# EAGLE design MCU_Module V1 (EAGLE 7.6.0)
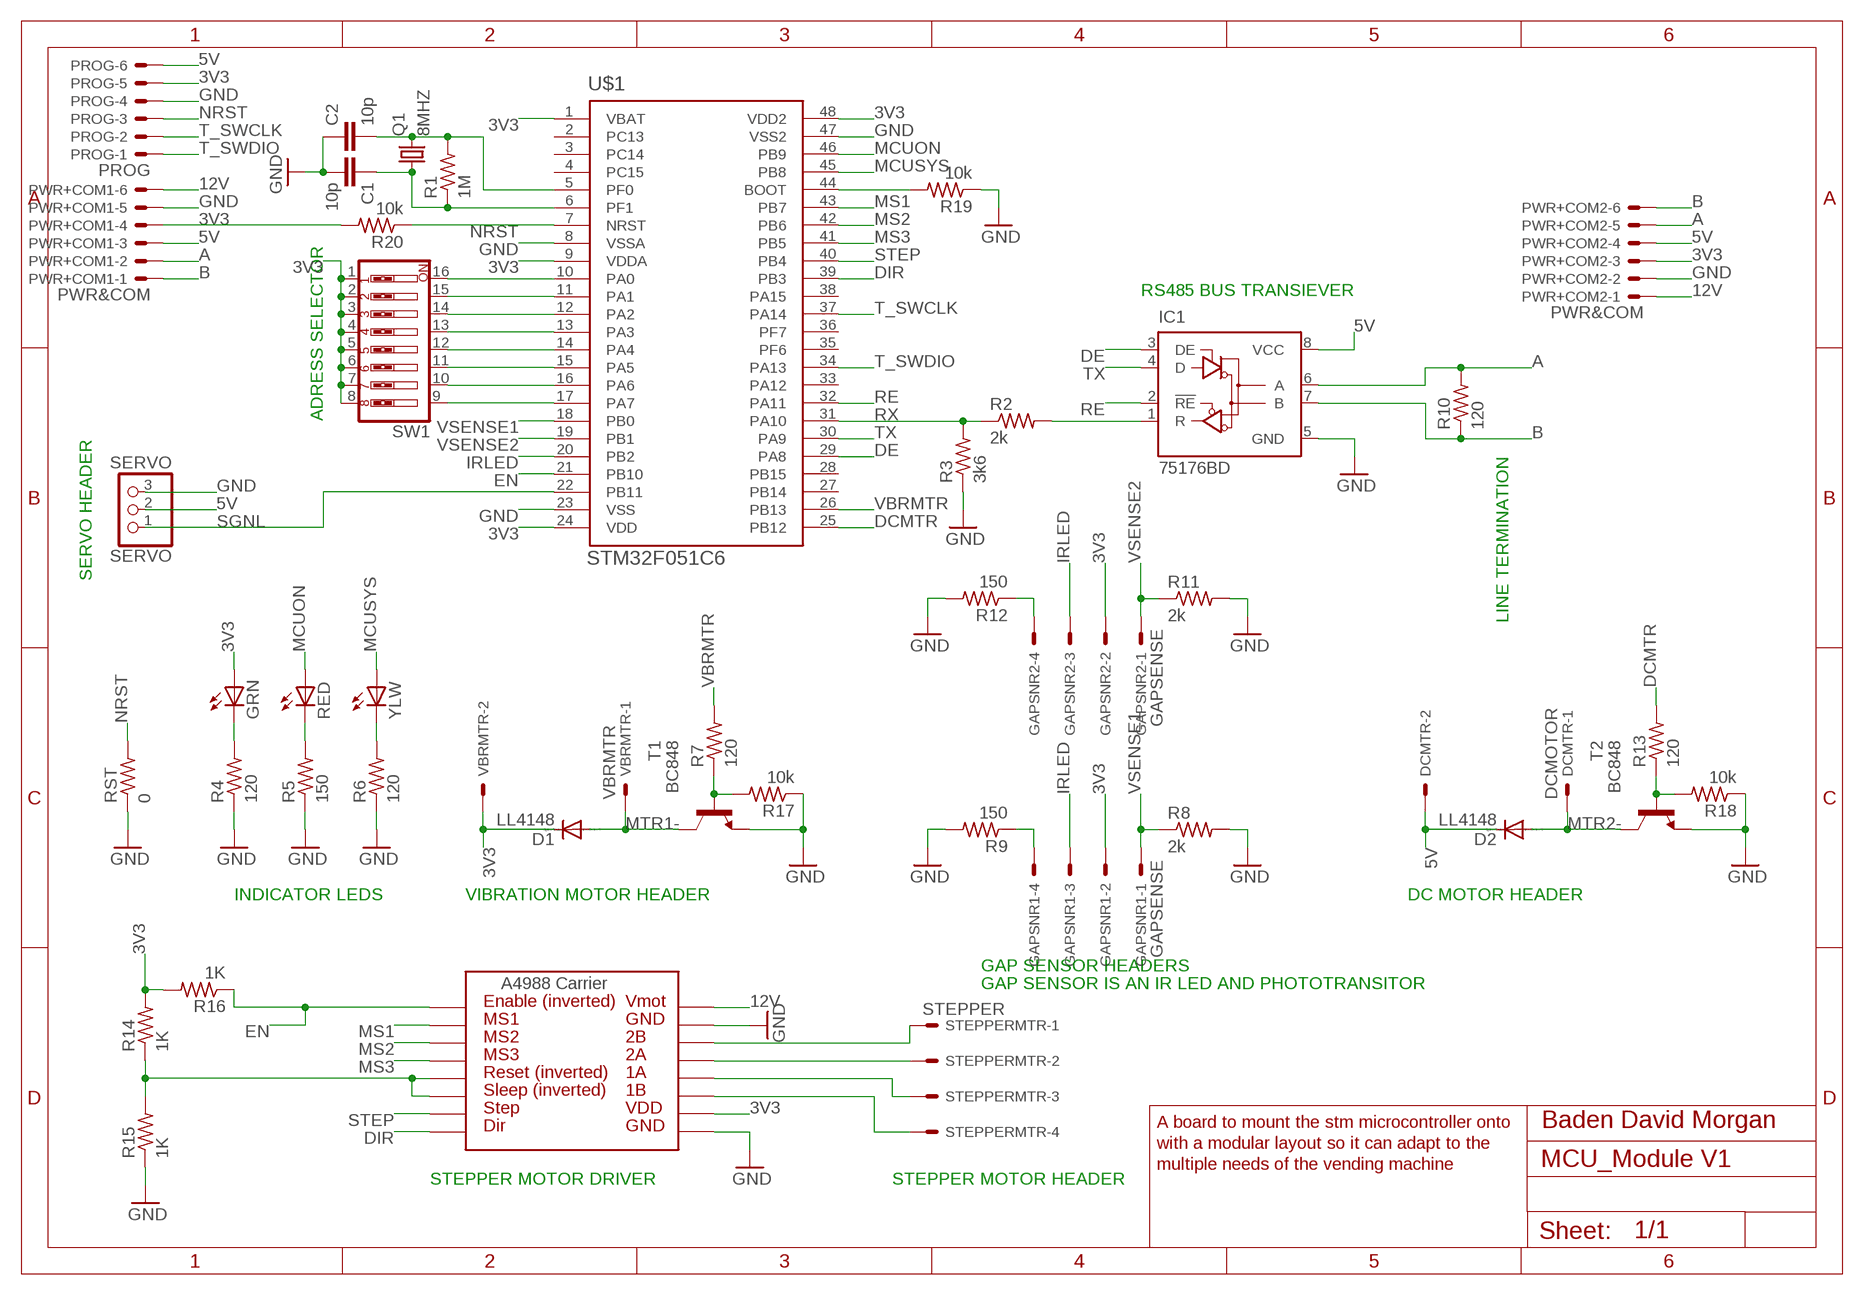
[diagram p0: schematic, sheet 1]

## Parts
C1  10p  C-EUC0805  [C0805]
C2  10p  C-EUC0805  [C0805]
D1  LL4148  PMLL4150  [SOD80C]
D2  LL4148  PMLL4150  [SOD80C]
DCMTR  DCMOTOR  22-27-2021-02  [6410-02]
GAPSNR1  GAPSENSE  22-27-2041-04  [6410-04]
GAPSNR2  GAPSENSE  22-27-2041-04  [6410-04]
GRN  LEDSML1206  [SML1206]
IC1  75176BD  75176AD  [D_R-PDSO-G8]
PROG  PROG  22-27-2061-06  [6410-06]
PWR+COM1  PWR&COM  22-05-7068-06  [7395-06]
PWR+COM2  PWR&COM  22-05-7068-06  [7395-06]
Q1  8MHZ  CRYSTALSM49  [SM49]
R1  1M  R-US_R0805  [R0805]
R2  2k  R-US_R0805  [R0805]
R3  3k6  R-US_R0805  [R0805]
R4  120  R-US_R0805  [R0805]
R5  150  R-US_R0805  [R0805]
R6  120  R-US_R0805  [R0805]
R7  120  R-US_R0805  [R0805]
R8  2k  R-US_R0805  [R0805]
R9  150  R-US_R0805  [R0805]
R10  120  R-US_R0805  [R0805]
R11  2k  R-US_R0805  [R0805]
R12  150  R-US_R0805  [R0805]
R13  120  R-US_R0805  [R0805]
R14  1K  R-US_R0805  [R0805]
R15  1K  R-US_R0805  [R0805]
R16  1K  R-US_R0805  [R0805]
R17  10k  R-US_R0805  [R0805]
R18  10k  R-US_R0805  [R0805]
R19  10k  R-US_R0805  [R0805]
R20  10k  R-US_R0805  [R0805]
RED  LEDSML1206  [SML1206]
RST  0  R-US_R0805  [R0805]
SERVO  SERVO  PINHD-1X3  [1X03]
STEPPERMTR  STEPPER  22-27-2041-04  [6410-04]
SW1  SW_DIP-8  [EDG-08]
T1  BC848  [SOT23]
T2  BC848  [SOT23]
U$1  STM32F051C6  [QFP50P900X900X160-48N]
U$2  A4983CARRIER  [A4988BREAKOUT]
VBRMTR  VBRMTR  22-27-2021-02  [6410-02]
YLW  LEDSML1206  [SML1206]

## Nets
3V3: D1.C GAPSNR1.2 GAPSNR2.2 GRN.A PROG.5 PWR+COM1.4 PWR+COM2.3 R14.2 R16.2 R20.2 SW1.1 SW1.2 SW1.3 SW1.4 SW1.5 SW1.6 SW1.7 SW1.8 U$1.1(VBAT) U$1.9(VDDA) U$1.24(VDD) U$1.48(VDD2) U$2.VDD VBRMTR.2
5V: D2.C DCMTR.2 IC1.8(VCC) PROG.6 PWR+COM1.3 PWR+COM2.4 SERVO.2
12V: PWR+COM1.6 PWR+COM2.1 U$2.VMOT
A: IC1.6(A) PWR+COM1.2 PWR+COM2.5 R10.2
B: IC1.7(B) PWR+COM1.1 PWR+COM2.6 R10.1
DCMTR: R13.2 U$1.25(PB12)
DE: IC1.3(DE) U$1.29(PA8)
DIR: U$1.39(PB3) U$2.DIR
EN: R16.1 U$1.21(PB10) U$2.EN
GND: C1.2 C2.1 IC1.5(GND) PROG.4 PWR+COM1.5 PWR+COM2.2 R3.1 R4.1 R5.1 R6.1 R8.2 R9.2 R11.2 R12.2 R15.1 R17.1 R18.1 R19.1 RST.1 SERVO.3 T1.2(E) T2.2(E) U$1.8(VSSA) U$1.23(VSS) U$1.47(VSS2) U$2.GND U$2.GND@0(GND)
IRLED: GAPSNR1.3 GAPSNR2.3 U$1.20(PB2)
MCUON: RED.A U$1.46(PB9)
MCUSYS: U$1.45(PB8) YLW.A
MS1: U$1.43(PB7) U$2.MS1
MS2: U$1.42(PB6) U$2.MS2
MS3: U$1.41(PB5) U$2.MS3
MTR1-: D1.A T1.3(C) VBRMTR.1
MTR2-: D2.A DCMTR.1 T2.3(C)
N$1: C1.1 Q1.1 R1.1 U$1.6(PF1)
N$2: C2.2 Q1.2 R1.2 U$1.5(PF0)
N$3: SW1.16 U$1.10(PA0)
N$4: R13.1 R18.2 T2.1(B)
N$5: STEPPERMTR.4 U$2.1B
N$6: SW1.15 U$1.11(PA1)
N$7: SW1.14 U$1.12(PA2)
N$8: SW1.13 U$1.13(PA3)
N$9: IC1.1(R) R2.2
N$10: SW1.12 U$1.14(PA4)
N$11: SW1.11 U$1.15(PA5)
N$12: SW1.10 U$1.16(PA6)
N$13: SW1.9 U$1.17(PA7)
N$14: GRN.C R4.2
N$15: R5.2 RED.C
N$16: R6.2 YLW.C
N$17: R7.1 R17.2 T1.1(B)
N$18: STEPPERMTR.3 U$2.1A
N$19: GAPSNR1.4 R9.1
N$20: STEPPERMTR.2 U$2.2A
N$21: STEPPERMTR.1 U$2.2B
N$22: R19.2 U$1.44(BOOT)
N$24: GAPSNR2.4 R12.1
N$26: R14.1 R15.2 U$2.RST U$2.SLP(SLEEP)
NRST: PROG.3 R20.1 RST.2 U$1.7(NRST)
RE: IC1.2(!RE) U$1.32(PA11)
RX: R2.1 R3.2 U$1.31(PA10)
SGNL: SERVO.1 U$1.22(PB11)
STEP: U$1.40(PB4) U$2.STEP
T_SWCLK: PROG.2 U$1.37(PA14)
T_SWDIO: PROG.1 U$1.34(PA13)
TX: IC1.4(D) U$1.30(PA9)
VBRMTR: R7.2 U$1.26(PB13)
VSENSE1: GAPSNR1.1 R8.1 U$1.18(PB0)
VSENSE2: GAPSNR2.1 R11.1 U$1.19(PB1)
Unconnected: U$1.2(PC13) U$1.3(PC14) U$1.4(PC15) U$1.27(PB14) U$1.28(PB15) U$1.33(PA12) U$1.35(PF6) U$1.36(PF7) U$1.38(PA15)

## Notes on the sheet
- RS485 BUS TRANSIEVER
- ADRESS SELECTOR
- LINE TERMINATION
- SERVO HEADER
- INDICATOR LEDS | VIBRATION MOTOR HEADER | DC MOTOR HEADER
- GAP SENSOR HEADERS
- GAP SENSOR IS AN IR LED AND PHOTOTRANSITOR
- A board to mount the stm microcontroller onto | Baden David Morgan
- with a modular layout so it can adapt to the
- multiple needs of the vending machine
- STEPPER MOTOR DRIVER | STEPPER MOTOR HEADER

## Library data of the parts
C1 C2 = rcl:C-EU: CAPACITOR, European symbol
D1 D2 = diode:PMLL4150: DIODE high speed
DCMTR VBRMTR = con-molex:22-?-02: CONNECTOR wire to board 2.54 mm (.1 inch) pitch header; OC_FARNELL: unknown; OC_NEWARK: unknown
GAPSNR1 GAPSNR2 STEPPERMTR = con-molex:22-?-04: CONNECTOR wire to board 2.54 mm (.1 inch) pitch header; OC_FARNELL: unknown; OC_NEWARK: unknown
GRN RED YLW = led:LED: LED OSRAM: - CHIPLED LG R971, LG N971, LY N971, LG Q971, LY Q971, LO R971, LY R971 LH N974, LH R974 LS Q976, LO Q976, LY Q976 LO Q996 - Hyper CHIPLED LW Q18S LB Q993, LB Q99A, LB R99A - SideLED LS A670, LO A670, LY A670, LG A670, LP A670 LB A673, LV A673, LT A673, LW A673 LH A674 LY A675 LS A676, LA A676, LO A676, LY A676, LW A676 LS A679, LY A679, LG A679 - Hyper Micro SIDELED® LS Y876, LA Y876, LO Y876, LY Y876 LT Y87S - SmartLED LW L88C, LW L88S LB L89C, LB L89S, LG L890 LS L89K, LO L89K, LY L89K LS L896, LA L896, LO L896, LY L896 - TOPLED LS T670, LO T670, LY T670, LG T670, LP T670 LSG T670, LSP T670, LSY T670, LOP T670, LYG T670 LG T671, LOG T671, LSG T671 LB T673, LV T673, LT T673, LW T673 LH T674 LS T676, LA T676, LO T676, LY T676, LB T676, LH T676, LSB T676, LW T676 LB T67C, LV T67C, LT T67C, LS T67K, LO T67K, LY T67K, LW E67C LS E67B, LA E67B, LO E67B, LY E67B, LB E67C, LV E67C, LT E67C LW T67C LS T679, LY T679, LG T679 LS T770, LO T770, LY T770, LG T770, LP T770 LB T773, LV T773, LT T773, LW T773 LH T774 LS E675, LA E675, LY E675, LS T675 LS T776, LA T776, LO T776, LY T776, LB T776 LHGB T686 LT T68C, LB T68C - Hyper Mini TOPLED® LB M676 - Mini TOPLED Santana® LG M470 LS M47K, LO M47K, LY M47K Source: http://www.osram.convergy.de LUXEON: - LUMILED® LXK2-PW12-R00, LXK2-PW12-S00, LXK2-PW14-U00, LXK2-PW14-V00 LXK2-PM12-R00, LXK2-PM12-S00, LXK2-PM14-U00 LXK2-PE12-Q00, LXK2-PE12-R00, LXK2-PE12-S00, LXK2-PE14-T00, LXK2-PE14-U00 LXK2-PB12-K00, LXK2-PB12-L00, LXK2-PB12-M00, LXK2-PB14-N00, LXK2-PB14-P00, LXK2-PB14-Q00 LXK2-PR12-L00, LXK2-PR12-M00, LXK2-PR14-Q00, LXK2-PR14-R00 LXK2-PD12-Q00, LXK2-PD12-R00, LXK2-PD12-S00 LXK2-PH12-R00, LXK2-PH12-S00 LXK2-PL12-P00, LXK2-PL12-Q00, LXK2-PL12-R00 Source: www.luxeon.com KINGBRIGHT: KA-3528ASYC Source: www.kingbright.com
IC1 = 751xx:75176A: DIFFERENTIAL BUS TRANSCEIVER Source: http://focus.ti.com/lit/ds/symlink/sn75176a.pdf
PROG PWR+COM1 PWR+COM2 = con-molex:22-?-06: CONNECTOR wire to board 2.54 mm (.1 inch) pitch header; OC_FARNELL: unknown; OC_NEWARK: unknown
Q1 = crystal:CRYSTAL: CRYSTAL; OC_FARNELL: unknown; OC_NEWARK: unknown
R1 R4-R7 R9 R12-R20 RST = rcl:R-US_: RESISTOR, American symbol
R2 R3 R8 R10 R11 = resistor:R-US_: RESISTOR, American symbol
SERVO = pinhead:PINHD-1X3: PIN HEADER
SW1 = special:SW_DIP-8: DIP SWITCH
T1 T2 = transistor:BC848: NPN TRANSISTOR
U$1 = STM32F0:STM32F051C6
U$2 = RepRapjr:A4983CARRIER

## Board
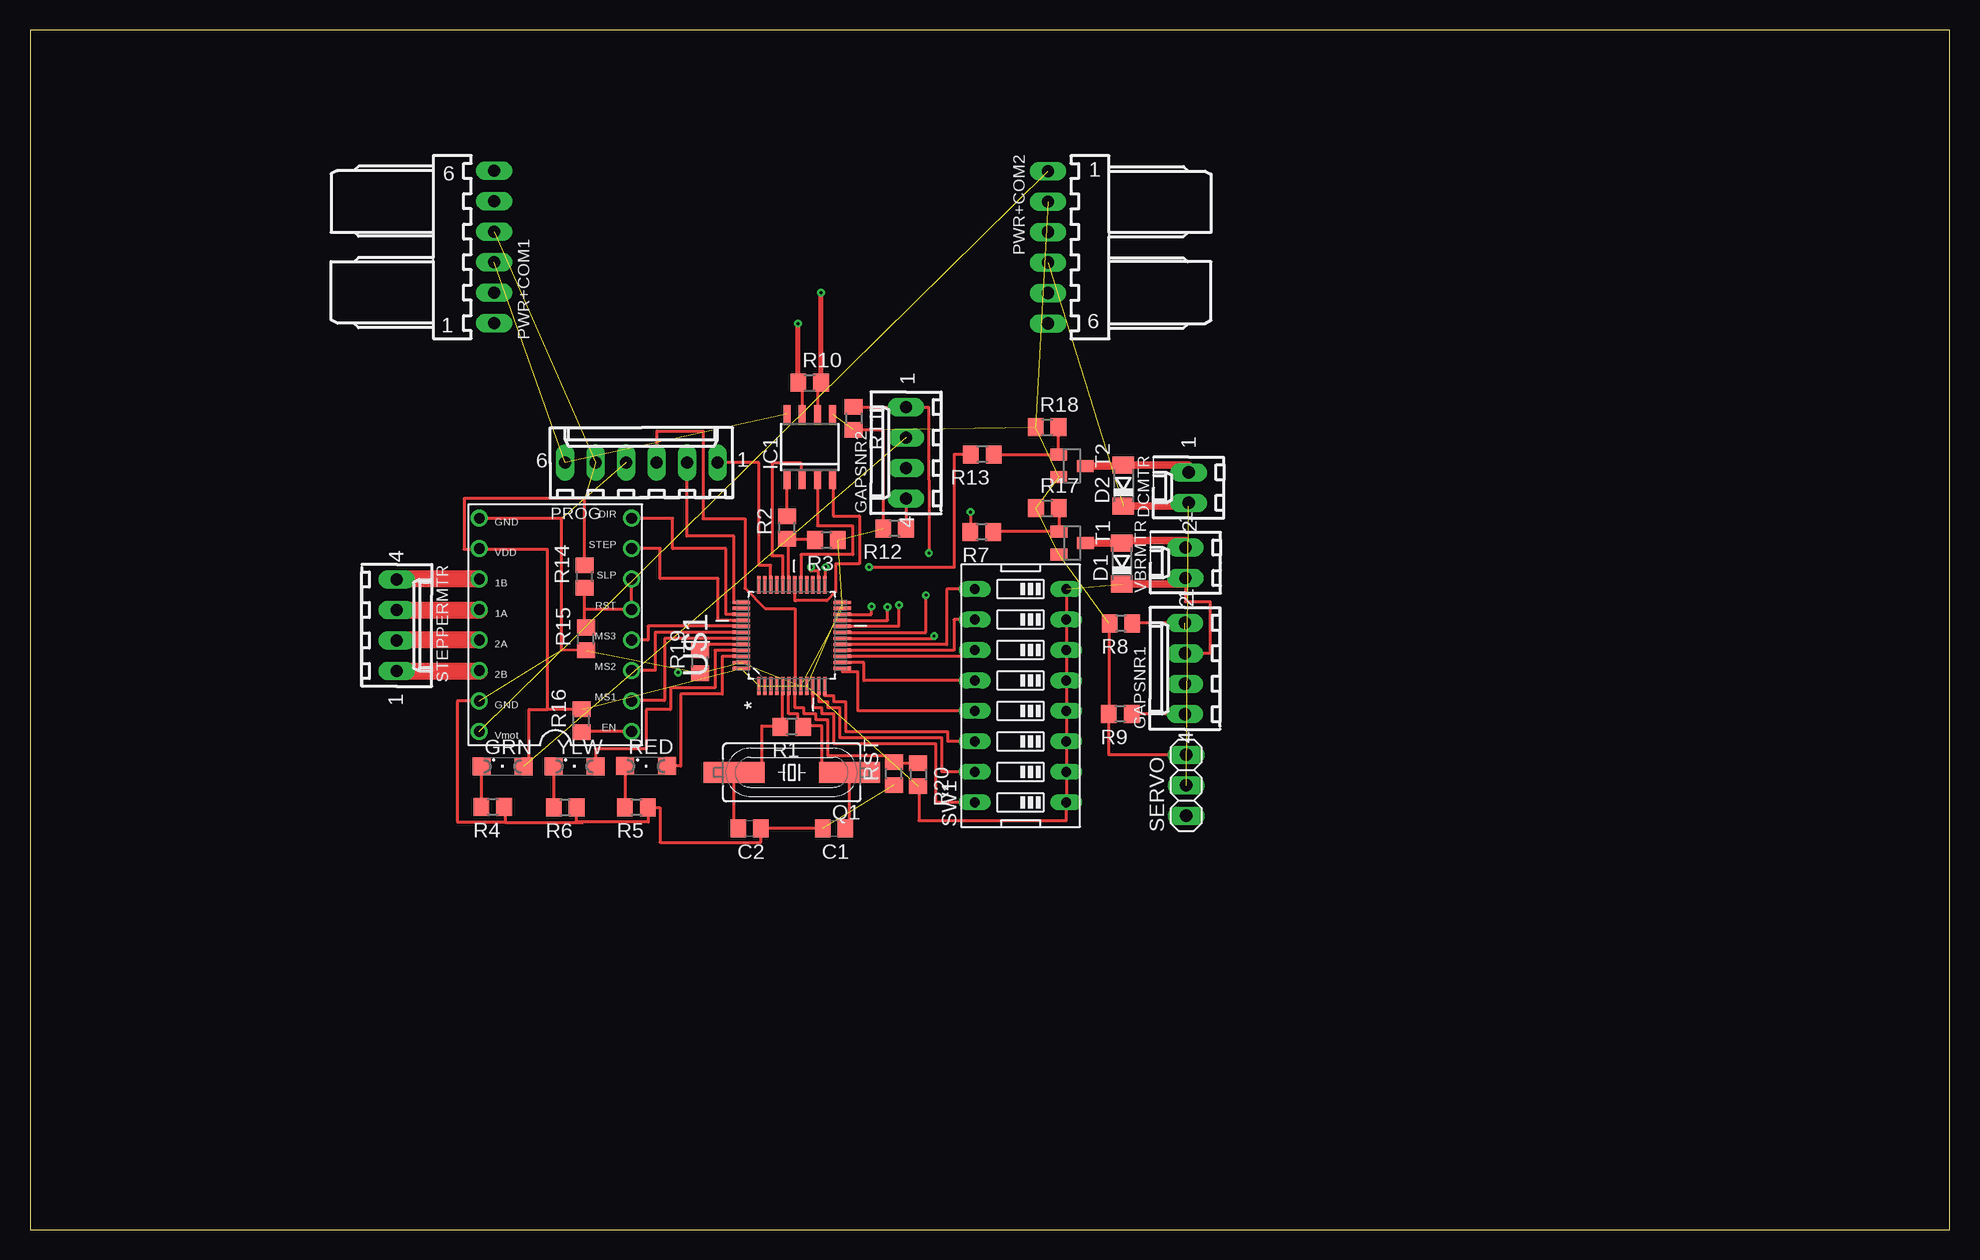
[diagram p1: board, top side]
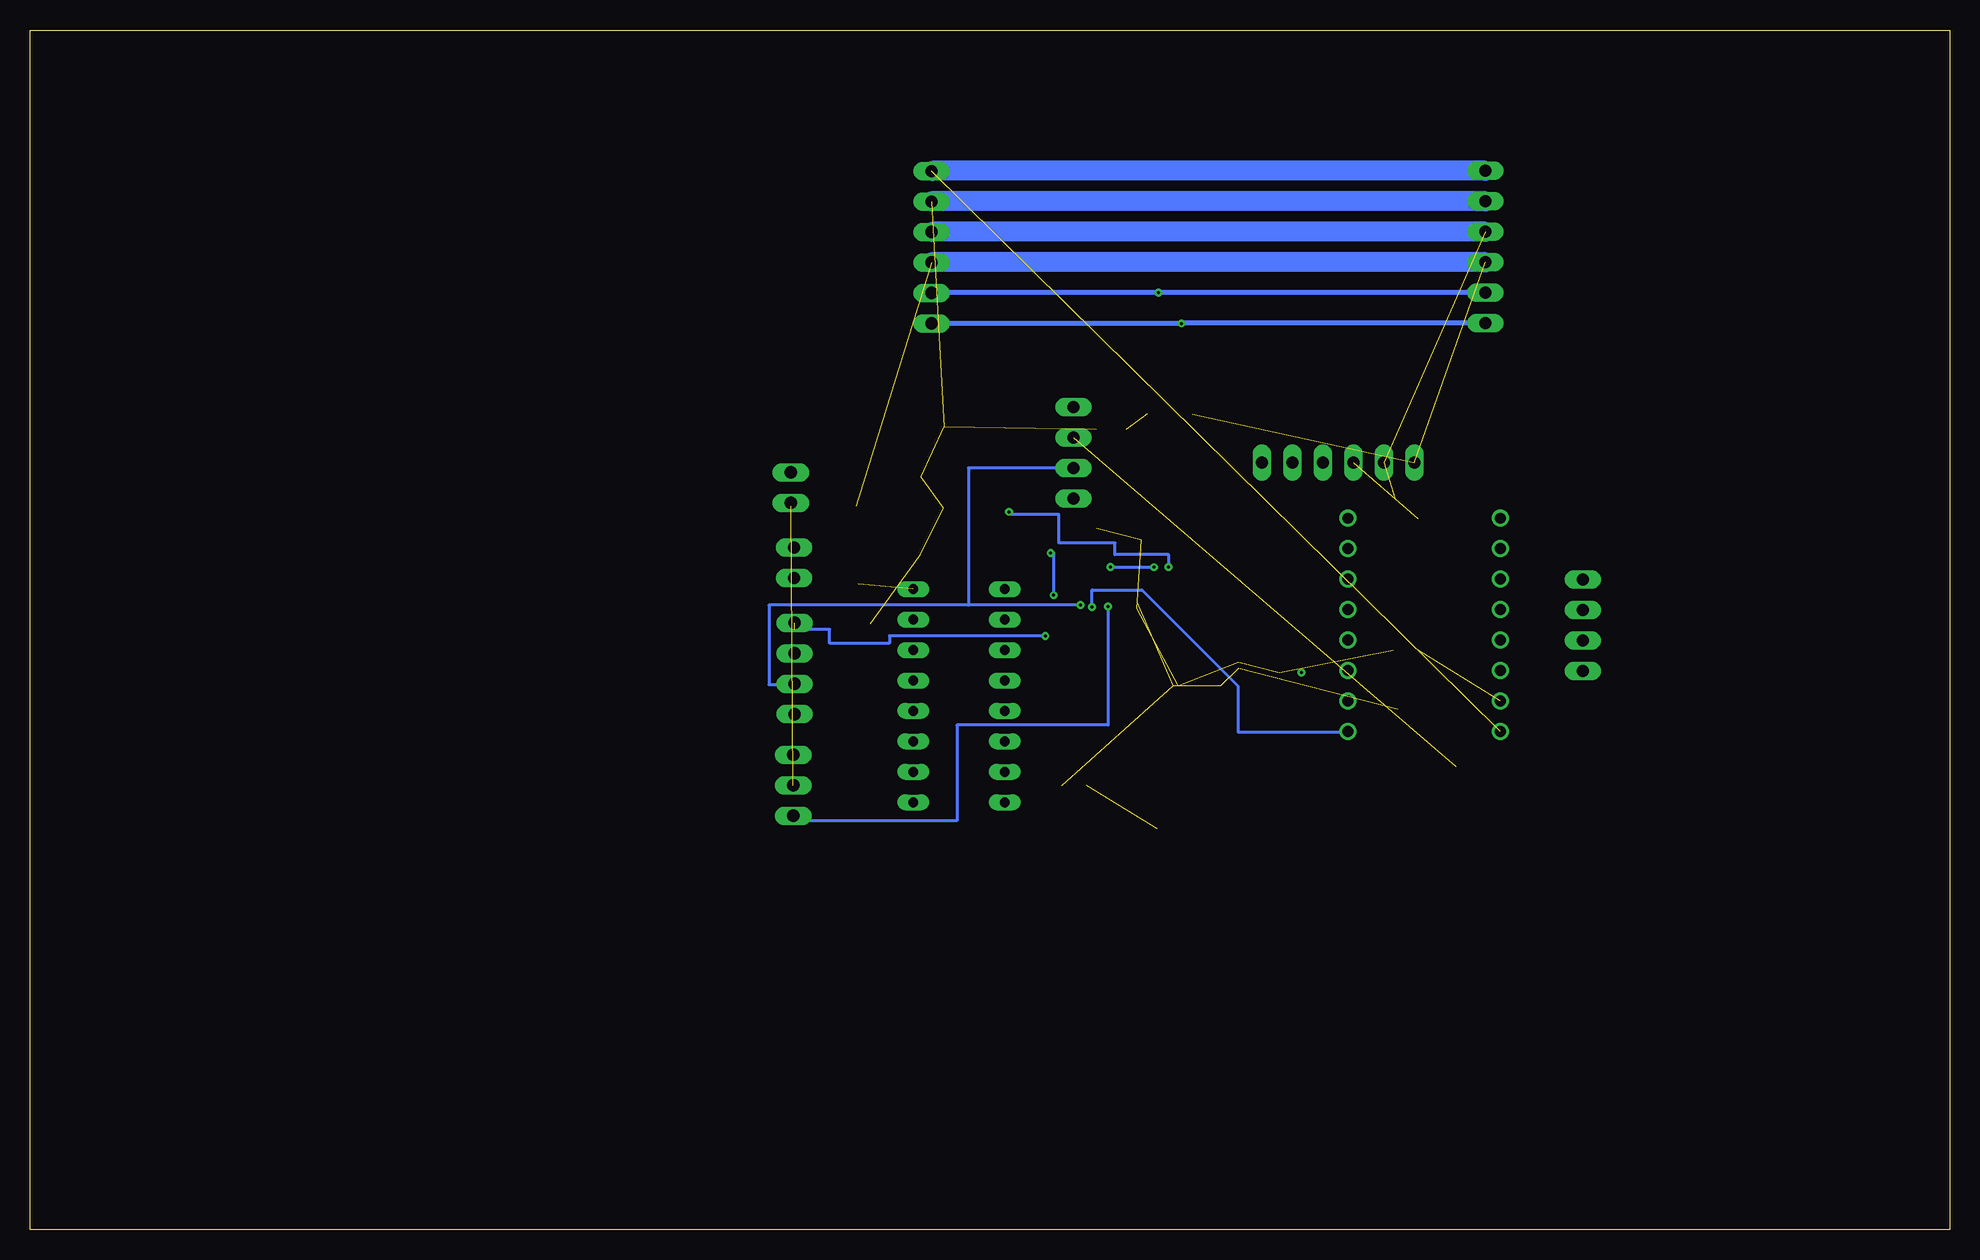
[diagram p2: board, bottom side, seen from below]

Size 160 x 100 mm. Coordinates in mm from the lower left corner, seen from the top.
Outline: 0,0 160,0 160,100 0,100 0,0
Copper layers (1*16): Top 0.035mm / dielectric 1.5mm / Bottom 0.035mm
Design rules "default *": minimum track width 10mil, minimum drill 0.25mil, track to track 8mil, track to pad 8mil, pad to pad 8mil, via to via 8mil, smd to smd 8mil, copper to edge 40mil, drill to drill 8mil, minimum pad ring 10mil, minimum via ring 8mil, stop-mask expansion 4mil, vias tented up to drill 0mil, thermal gap 10mil

### Footprints (pad centres in the part's own frame; a part is rotated, then mirrored left to right if it is on the bottom)
C0805 = smd 1.3 x 1.5: 1 -0.95,0; 2 0.95,0
SOD80C = smd 1.4 x 1.8: A 1.7,0; C -1.7,0
6410-02 = drill 1.016 long: 1 1.27,0; 2 -1.27,0
6410-04 = drill 1.016 long: 1 3.81,0; 2 1.27,0; 3 -1.27,0; 4 -3.81,0
SML1206 = smd 1.5 x 1.5: A 1.75,0; C -1.75,0
D_R-PDSO-G8 = smd 0.6 x 1.5: 1 -1.905,-2.75; 2 -0.635,-2.75; 3 0.635,-2.75; 4 1.905,-2.75; 5 1.905,2.75; 6 0.635,2.75; 7 -0.635,2.75; 8 -1.905,2.75
6410-06 = drill 1.016 long: 1 6.35,0; 2 3.81,0; 3 1.27,0; 4 -1.27,0; 5 -3.81,0; 6 -6.35,0
7395-06 = drill 1.016 long: 1 6.35,0; 2 3.81,0; 3 1.27,0; 4 -1.27,0; 5 -3.81,0; 6 -6.35,0
SM49 = smd 5.08 x 1.778: 1 -4.826,0; 2 4.826,0
R0805 = smd 1.3 x 1.5: 1 -0.95,0; 2 0.95,0
1X03 = drill 1.016 long: 1 -2.54,0; 2 0,0; 3 2.54,0
EDG-08 = drill 0.813 long: 1 -8.89,-3.81; 2 -6.35,-3.81; 3 -3.81,-3.81; 4 -1.27,-3.81; 5 1.27,-3.81; 6 3.81,-3.81; 7 6.35,-3.81; 8 8.89,-3.81; 9 8.89,3.81; 10 6.35,3.81; 11 3.81,3.81; 12 1.27,3.81; 13 -1.27,3.81; 14 -3.81,3.81; 15 -6.35,3.81; 16 -8.89,3.81
SOT23 = smd 1 x 1.4: 1 -0.95,-1.1; 2 0.95,-1.1; 3 0,1.1
QFP50P900X900X160-48N = smd 1.473 x 0.279: 1 -4.216,2.743; 2 -4.216,2.261; 3 -4.216,1.753; 4 -4.216,1.245; 5 -4.216,0.762; 6 -4.216,0.254; 7 -4.216,-0.254; 8 -4.216,-0.762; 9 -4.216,-1.245; 10 -4.216,-1.753; 11 -4.216,-2.261; 12 -4.216,-2.743; 25 4.216,-2.743; 26 4.216,-2.261; 27 4.216,-1.753; 28 4.216,-1.245; 29 4.216,-0.762; 30 4.216,-0.254; 31 4.216,0.254; 32 4.216,0.762; 33 4.216,1.245; 34 4.216,1.753; 35 4.216,2.261; 36 4.216,2.743 | smd 0.279 x 1.473: 13 -2.743,-4.216; 14 -2.261,-4.216; 15 -1.753,-4.216; 16 -1.245,-4.216; 17 -0.762,-4.216; 18 -0.254,-4.216; 19 0.254,-4.216; 20 0.762,-4.216; 21 1.245,-4.216; 22 1.753,-4.216; 23 2.261,-4.216; 24 2.743,-4.216; 37 2.743,4.216; 38 2.261,4.216; 39 1.753,4.216; 40 1.245,4.216; 41 0.762,4.216; 42 0.254,4.216; 43 -0.254,4.216; 44 -0.762,4.216; 45 -1.245,4.216; 46 -1.753,4.216; 47 -2.261,4.216; 48 -2.743,4.216
A4988BREAKOUT = drill 0.9: 1A 8.89,1.27; 1B 11.43,1.27; 2A 6.35,1.27; 2B 3.81,1.27; DIR 16.51,-11.43; EN -1.27,-11.43; GND 16.51,1.27; GND@0 1.27,1.27; MS1 1.27,-11.43; MS2 3.81,-11.43; MS3 6.35,-11.43; RST 8.89,-11.43; SLP 11.43,-11.43; STEP 13.97,-11.43; VDD 13.97,1.27; VMOT -1.27,1.27

### Placement (x,y rotation side)
C1  67.02,33.42 180 top
C2  59.98,33.42 180 top
D1  91,55.52 90 top
D2  91.13,62.02 90 top
DCMTR  96.58,61.85 90 top
GAPSNR1  96.27,46.77 90 top
GAPSNR2  73.02,64.75 90 top
GRN  39.38,38.61 0 top
IC1  65,65.23 0 top
PROG  50.96,63.93 0 top
PWR+COM1  38.69,81.91 270 top
PWR+COM2  84.86,81.89 90 top
Q1  63.5,38.1 180 top
R1  63.5,41.91 180 top
R2  63.11,58.52 90 top
R3  66.39,57.46 180 top
R4  38.57,35.21 180 top
R5  50.54,35.18 180 top
R6  44.61,35.17 180 top
R7  79.34,58.15 180 top
R8  90.94,50.53 180 top
R9  90.87,42.97 180 top
R10  64.99,70.59 0 top
R11  68.66,67.62 270 top
R12  72.07,58.43 180 top
R13  79.37,64.62 180 top
R14  46.23,54.44 90 top
R15  46.34,49.24 90 top
R16  45.96,42.42 90 top
R17  84.8,60.13 0 top
R18  84.78,66.88 0 top
R19  55.86,47.33 90 top
R20  74.04,37.91 270 top
RED  51.35,38.63 0 top
RST  72,38 90 top
SERVO  96.38,37.04 90 top
STEPPERMTR  30.57,50.37 270 top
SW1  82.57,44.5 90 top
T1  86.87,57.22 270 top
T2  86.85,63.66 270 top
U$1  63.5,49.53 90 top
U$2  38.72,42.79 90 top
VBRMTR  96.32,55.59 90 top
YLW  45.39,38.62 0 top

### Tracks (layer width: path | path; a pad name or v marks a point on that pad's centre or on a via)
3V3  (9 unrouted)
  Top 0.254: SW1.8 SW1.7 SW1.6 SW1.5 SW1.4 SW1.3 SW1.2 SW1.1 86.38,34.1 74.1,34.1 74.1,36.96 R20.2 | VBRMTR.2 96.3,54.32 96.3,52.34 98.37,52.34 98.37,48.04 GAPSNR1.2 | R14.2 46.24,55.48 46.24,60.93 36.18,60.92 36.18,56.72 37.45,56.72 U$2.VDD 37.45,56.68 43.14,56.69 43.14,56.42 43.13,56.41 43.13,43.37 | R16.2 43.13,43.37 | GRN.A 41.61,38.61 41.61,43.37 43.13,43.37
  Top 0.61: D1.C 96.32,53.82 VBRMTR.2
  Bottom 1.422: 84.79,83.18 PWR+COM2.3
  Bottom 1.676: PWR+COM1.4 84.79,83.18
5V  (4 unrouted)
  Top 0.61: D2.C 96.58,60.32 DCMTR.2
  Bottom 1.676: PWR+COM1.3 84.86,80.64 PWR+COM2.4
12V  (1 unrouted)
  Bottom 1.422: 84.79,88.26 PWR+COM2.1
  Bottom 1.676: PWR+COM1.6 84.79,88.26
A  (via drill 0.25)
  Top 0.254: R10.2 65.64,70.59 IC1.6
  Top 0.406: R10.2 v65.95,78.11
  Bottom 0.406: PWR+COM1.2 v65.95,78.1 v65.95,78.11 84.86,78.11 PWR+COM2.5
B  (via drill 0.25)
  Top 0.254: R10.1 64.36,70.59 IC1.7
  Top 0.406: R10.1 64.02,70.59 v64.02,75.54
  Bottom 0.406: PWR+COM1.1 64.02,75.56 v64.02,75.54 PWR+COM2.6
DCMTR  (via drill 0.25)
  Top 0.254: U$1.25 v66.32,55.21 | v69.94,55.22 77.05,55.22 77.05,64.63 R13.2
  Bottom 0.254: v69.94,55.22 66.25,55.22 v66.32,55.21
DE
  Top 0.254: IC1.3 65.63,58.68 68.58,58.68 68.58,56.33 68.59,56.33 68.59,56.27 64.26,56.27 U$1.29
DIR
  Top 0.254: U$1.39 58,51.28 58,56.77 53.57,56.77 53.57,59.28 50.15,59.28 U$2.DIR
EN  (via drill 0.25)
  Top 0.254: U$1.21 71.48,50.77 v71.48,51.9 | U$2.EN 45.97,41.52 R16.1
  Bottom 0.254: v71.48,51.9 71.46,51.9 71.46,53.33 67.32,53.33 59.3,45.31 59.3,41.48 59.31,41.47 50.2,41.47 U$2.EN
GND  (16 unrouted)
  Top 0.254: C1.2 C2.1 60.93,32.29 52.51,32.29 52.51,35.18 R5.1 51.53,35.18 51.53,33.96 46.09,33.96 | R8.2 89.92,50.53 R9.2 89.92,39.58 SERVO.3 | R15.1 44.32,48.31 44.32,59.29 U$2.GND | 46.09,33.96 45.56,33.96 R6.1 | R4.1 39.59,35.21 39.59,33.99 | 46.09,33.96 46.09,33.94 39.59,33.94 39.59,33.99 | U$2.GND@0 35.61,44.06 35.61,33.99 39.59,33.99 | R11.2 71.12,66.67 R12.2
  Bottom 1.676: PWR+COM1.5 84.86,85.72 PWR+COM2.2
IRLED  (via drill 0.26)
  Top 0.254: U$1.20 72.43,50.29 v72.43,52.06
  Bottom 0.254: v72.43,52.06 81.79,52.06 | 81.79,52.06 98.4,52.06 98.4,45.42 96.27,45.42 GAPSNR1.3 | GAPSNR2.3 81.79,63.48 81.79,52.06
MCUON
  Top 0.254: U$1.46 57.69,47.78 57.69,44.64 54.24,44.64 54.24,38.63 RED.A
MCUSYS
  Top 0.254: U$1.45 57.1,48.28 57.1,45.15 53.38,45.15 53.38,43.34 51.37,43.34 51.37,40.07 47.14,40.07 YLW.A
MS1
  Top 0.254: U$1.43 52.91,49.29 52.89,44.09 50.15,44.09 U$2.MS1
MS2
  Top 0.254: U$1.42 52.12,49.78 52.12,46.62 50.15,46.62 U$2.MS2
MS3
  Top 0.254: U$1.41 51.52,50.29 51.52,49.13 U$2.MS3
MTR1-
  Top 0.61: T1.3 D1.A 91.14,57.22 91.14,57.42 96.32,57.42 VBRMTR.1
MTR2-
  Top 0.61: T2.3 91.13,63.66 D2.A 96.58,63.72 DCMTR.1
N$1
  Top 0.254: U$1.6 63.25,43 64,43 64,41.91 R1.1 64.45,42 66,42 66,38.1 Q1.1 68.33,33.42 C1.1
N$2
  Top 0.254: U$1.5 62.74,41.91 R1.2 62.55,42 61,42 61,38.1 Q1.2 58.67,33.42 C2.2
N$3
  Top 0.254: SW1.16 75.5,35.61 75.5,40.5 67,40.5 67,43 66,43 66,43.5 65.25,43.5 U$1.10
N$4
  Top 0.254: R18.2 85.73,64.61 T2.1 R13.1
N$5
  Top 0.254: 30.57,54.22 STEPPERMTR.4
  Top 1.422: U$2.1B 30.57,54.22
N$6
  Top 0.254: SW1.15 76,38.15 76,41 67.5,41 67.5,43.5 66.5,43.5 66.5,44 65.76,44 U$1.11
N$7
  Top 0.254: SW1.14 76.5,40.69 76.5,41.5 68,41.5 68,44 67,44 67,44.5 66.24,44.5 U$1.12
N$8
  Top 0.254: SW1.13 69,43.23 69,46.5 67.72,46.5 U$1.13
N$9
  Top 0.254: R2.2 63.09,59.47 IC1.1
N$10
  Top 0.254: SW1.12 69.5,45.77 69.5,47.27 U$1.14
N$11
  Top 0.254: SW1.11 78.8,48.31 78.77,47.78 U$1.15
N$12
  Top 0.254: SW1.10 77,50.85 77,48.28 67.76,48.28 U$1.16
N$13
  Top 0.254: SW1.9 76.4,53.39 76.41,48.77 U$1.17
N$14
  Top 0.254: GRN.C R4.2
N$15
  Top 0.254: RED.C R5.2
N$16
  Top 0.254: YLW.C 43.66,38.62 R6.2
N$17
  Top 0.254: R7.1 80.29,58.17 T1.1 85.77,60.13 R17.2
N$18
  Top 0.254: 37.45,51.64 U$2.1A
  Top 1.422: STEPPERMTR.3 37.45,51.64
N$19
  Top 0.254: GAPSNR1.4 R9.1
N$20
  Top 0.254: 30.57,49.14 STEPPERMTR.2
  Top 1.422: U$2.2A 30.57,49.14
N$21
  Top 0.254: 37.45,46.56 U$2.2B
  Top 1.422: STEPPERMTR.1 37.45,46.56
N$22
  Top 0.254: U$1.44 56.12,48.77 R19.2
N$23  (via drill 0.25)
  other vias: 54.03,46.43
N$24
  Top 0.254: GAPSNR2.4 R12.1
N$26
  Top 0.254: U$2.SLP U$2.RST 46.23,51.68 | R15.2 46.23,50.63 46.23,51.68 | 46.23,51.68 R14.1
NRST
  Top 0.254: R20.1 72,38.86 RST.2 72,39.5 66.5,39.5 66.5,42.5 65.5,42.5 65.5,43 64.5,43 64.5,43.5 63.75,43.5 U$1.7 63.75,51.76 61.29,51.76 59.59,53.46 59.59,59.26 56.09,59.26 56.09,66.57 52.26,66.57 52.26,63.93 PROG.3
RE
  Top 0.254: IC1.2 64.31,62.48 | 64.28,62.48 64.31,62.48 | 64.31,62.48 64.31,63.88 61.84,63.88 61.84,56.17 62.74,56.17 U$1.32
RX
  Top 0.254: U$1.31 63.24,57 63.23,57 63.23,57.05 63.11,57.05 R2.1 65.44,57.57 R3.2
SGNL  (via drill 0.25)
  Top 0.254: U$1.22 70.14,51.28 v70.14,51.93
  Bottom 0.254: v70.14,51.93 70.14,42.05 82.74,42.05 82.74,34.08 96.38,34.08 SERVO.1
STEP
  Top 0.254: U$1.40 57.37,50.77 57.37,54.26 52.54,54.26 52.54,56.79 50.15,56.79 U$2.STEP 50.15,56.78
T_SWCLK
  Top 0.254: U$1.37 58.68,52.27 58.68,57.81 54.77,57.81 PROG.2
T_SWDIO
  Top 0.254: U$1.34 61.74,55.36 60.77,55.36 60.77,63.93 PROG.1
TX
  Top 0.254: IC1.4 66.95,62.48 66.95,59.49 69.14,59.49 69.14,55.5 67.16,55.5 67.16,53.17 66.42,52.43 63.85,52.43 63.84,52.42 63.75,52.42 U$1.30
VBRMTR  (via drill 0.25)
  Top 0.254: U$1.26 65.71,54.89 65.08,54.89 v65.09,55.23 | v78.39,59.83 R7.2
  Bottom 0.254: v65.09,55.23 65.1,56.26 69.57,56.26 69.56,57.23 74.24,57.23 74.24,59.61 78.39,59.61 v78.39,59.83
VSENSE1  (via drill 0.25)  (1 unrouted)
  Top 0.254: GAPSNR1.1 91.89,50.58 R8.1 | U$1.18 75.36,49.29 v75.37,49.48
  Bottom 0.254: v75.37,49.48 88.36,49.5 88.36,48.86 93.34,48.86 93.34,50.04 96.27,50.04
VSENSE2  (via drill 0.25)
  Top 0.254: R11.1 GAPSNR2.1 74.91,68.56 v74.92,56.41 | U$1.19 74.67,49.78 v74.67,52.88
  Bottom 0.254: v74.92,56.41 74.67,56.41 v74.67,52.88